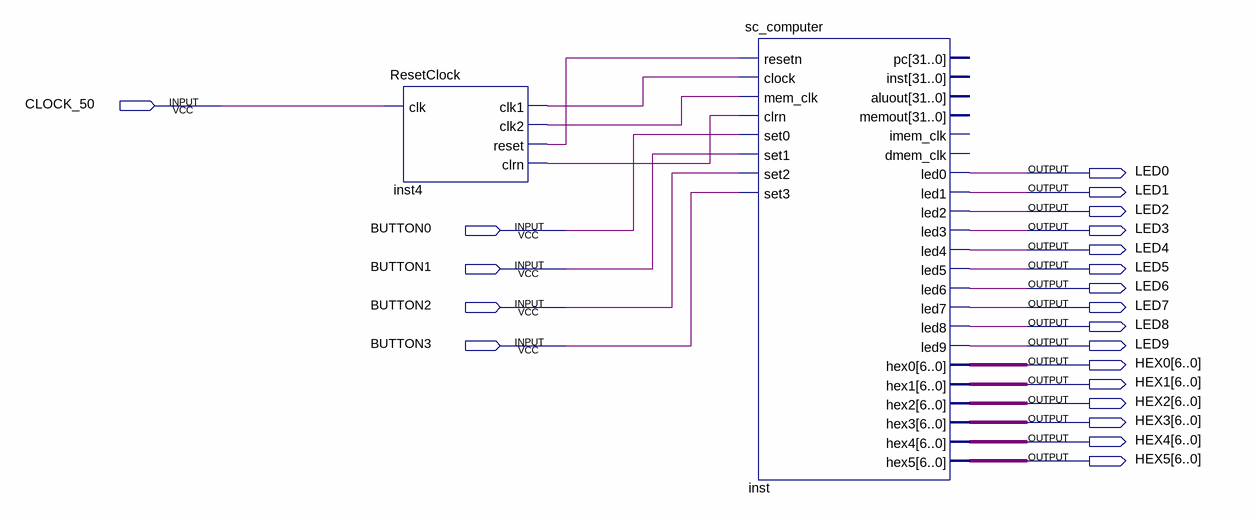
[diagram p0: schematic sheet]
// Quartus schematic sc_computer_pin.bdf as structural Verilog: 2 symbols, 21 pins
module sc_computer_pin (
  input  CLOCK_50,
  input  BUTTON0,
  input  BUTTON1,
  input  BUTTON2,
  input  BUTTON3,
  output LED0,
  output LED1,
  output LED2,
  output LED3,
  output LED4,
  output LED5,
  output LED6,
  output LED7,
  output LED8,
  output LED9,
  output [6:0] HEX0,
  output [6:0] HEX1,
  output [6:0] HEX2,
  output [6:0] HEX3,
  output [6:0] HEX4,
  output [6:0] HEX5
);

  wire inst4_clk1, inst4_clk2, inst4_clrn, inst4_reset;

  ResetClock inst4 (.clk(CLOCK_50), .clk1(inst4_clk1), .clk2(inst4_clk2), .reset(inst4_reset), .clrn(inst4_clrn));
  sc_computer inst (
    .resetn(inst4_reset), .clock(inst4_clk1), .mem_clk(inst4_clk2), .clrn(inst4_clrn), .set0(BUTTON0),
    .set1(BUTTON1), .set2(BUTTON2), .set3(BUTTON3), .led0(LED0), .led1(LED1), .led2(LED2), .led3(LED3),
    .led4(LED4), .led5(LED5), .led6(LED6), .led7(LED7), .led8(LED8), .led9(LED9), .hex0(HEX0), .hex1(HEX1),
    .hex2(HEX2), .hex3(HEX3), .hex4(HEX4), .hex5(HEX5));  // open: pc, inst, aluout, memout, imem_clk, dmem_clk
endmodule
